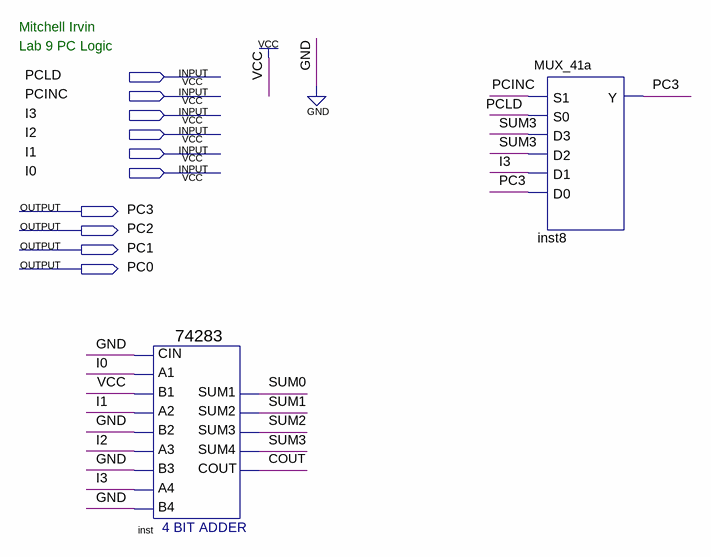
[diagram p0: schematic sheet]
// Quartus schematic PC.bdf as structural Verilog: 2 symbols, 10 pins
module PC (
  input  PCLD,
  input  PCINC,
  input  I3,
  input  I2,
  input  I1,
  input  I0,
  output PC3,
  output PC2,
  output PC1,
  output PC0
);

  wire COUT, SUM0, SUM1, SUM2, SUM3;

  \74283  inst (
    .CIN(1'b0), .A1(I0), .A2(I1), .B2(1'b0), .A3(I2), .A4(I3), .B4(1'b0), .B1(1'b1), .B3(1'b0), .SUM4(SUM3),
    .COUT(COUT), .SUM1(SUM0), .SUM2(SUM1), .SUM3(SUM2));
  MUX_41a inst8 (.S1(PCINC), .S0(PCLD), .D3(SUM3), .D2(SUM3), .D1(I3), .D0(PC3), .Y(PC3));

  // Notes on the sheet:
  //   Mitchell Irvin
  //   Lab 9 PC Logic
endmodule
